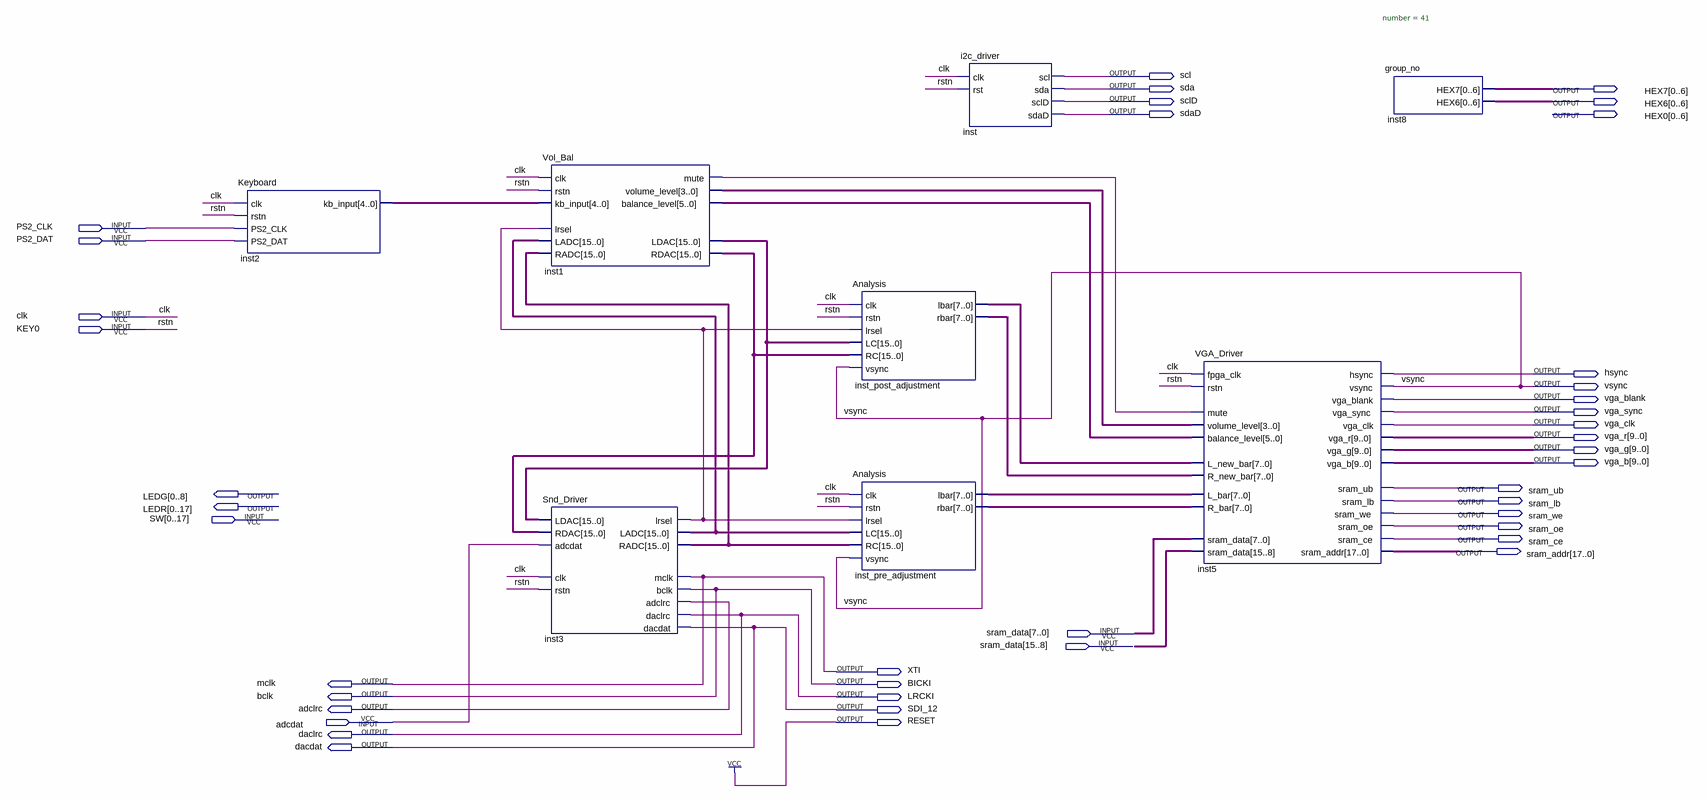
[diagram p0: schematic sheet]
// Quartus schematic Proj.bdf as structural Verilog: 8 symbols, 41 pins
module Proj (
  input  PS2_CLK,
  input  PS2_DAT,
  input  clk,
  input  KEY0,
  input  [0:17] SW,
  input  [15:0] sram_data,
  input  adcdat,
  output scl,
  output sda,
  output [0:6] HEX7,
  output sclD,
  output [0:6] HEX6,
  output sdaD,
  output [0:6] HEX0,
  output hsync,
  output vsync,
  output vga_blank,
  output vga_sync,
  output vga_clk,
  output [9:0] vga_r,
  output [9:0] vga_g,
  output [9:0] vga_b,
  output sram_ub,
  output [0:8] LEDG,
  output sram_lb,
  output [0:17] LEDR,
  output sram_we,
  output sram_oe,
  output sram_ce,
  output [17:0] sram_addr,
  output XTI,
  output mclk,
  output BICKI,
  output bclk,
  output LRCKI,
  output adclrc,
  output SDI_12,
  output RESET,
  output daclrc,
  output dacdat
);

  wire inst1_mute, inst3_lrsel;
  wire [3:0] inst1_volume_level;
  wire [4:0] inst2_kb_input;
  wire [5:0] inst1_balance_level;
  wire [7:0] inst_post_adjustment_lbar, inst_post_adjustment_rbar, inst_pre_adjustment_lbar,
       inst_pre_adjustment_rbar;
  wire [15:0] inst1_ldac, inst1_rdac, inst3_ladc, inst3_radc;

  Keyboard inst2 (.rstn(KEY0), .clk(clk), .PS2_CLK(PS2_CLK), .PS2_DAT(PS2_DAT), .kb_input(inst2_kb_input));
  Vol_Bal inst1 (
    .clk(clk), .rstn(KEY0), .lrsel(inst3_lrsel), .LADC(inst3_ladc), .RADC(inst3_radc),
    .kb_input(inst2_kb_input), .LDAC(inst1_ldac), .RDAC(inst1_rdac), .mute(inst1_mute),
    .volume_level(inst1_volume_level), .balance_level(inst1_balance_level));
  Snd_Driver inst3 (
    .clk(clk), .rstn(KEY0), .adcdat(adcdat), .LDAC(inst1_ldac), .RDAC(inst1_rdac), .mclk(mclk), .bclk(bclk),
    .adclrc(adclrc), .daclrc(daclrc), .lrsel(inst3_lrsel), .dacdat(dacdat), .LADC(inst3_ladc),
    .RADC(inst3_radc));
  Analysis inst_post_adjustment (
    .clk(clk), .rstn(KEY0), .lrsel(inst3_lrsel), .LC(inst1_ldac), .RC(inst1_rdac), .vsync(vsync),
    .lbar(inst_post_adjustment_lbar), .rbar(inst_post_adjustment_rbar));
  Analysis inst_pre_adjustment (
    .clk(clk), .rstn(KEY0), .lrsel(inst3_lrsel), .LC(inst3_ladc), .RC(inst3_radc), .vsync(vsync),
    .lbar(inst_pre_adjustment_lbar), .rbar(inst_pre_adjustment_rbar));
  i2c_driver inst (.clk(clk), .rst(KEY0), .scl(scl), .sda(sda), .sclD(sclD), .sdaD(sdaD));
  VGA_Driver inst5 (
    .fpga_clk(clk), .rstn(KEY0), .sram_data(sram_data), .mute(inst1_mute), .volume_level(inst1_volume_level),
    .balance_level(inst1_balance_level), .L_new_bar(inst_post_adjustment_lbar),
    .R_new_bar(inst_post_adjustment_rbar), .L_bar(inst_pre_adjustment_lbar),
    .R_bar(inst_pre_adjustment_rbar), .hsync(hsync), .vsync(vsync), .sram_ce(sram_ce), .sram_oe(sram_oe),
    .sram_we(sram_we), .sram_lb(sram_lb), .sram_ub(sram_ub), .sram_addr(sram_addr), .vga_r(vga_r),
    .vga_g(vga_g), .vga_b(vga_b), .vga_blank(vga_blank), .vga_sync(vga_sync), .vga_clk(vga_clk));
  group_no #(.number(41)) inst8 (.HEX7(HEX7), .HEX6(HEX6));

  assign BICKI = bclk;
  assign LRCKI = daclrc;
  assign RESET = 1'b1;
  assign SDI_12 = dacdat;
  assign XTI = mclk;

  // Other names for the same wires on the sheet: rstn = KEY0
endmodule
